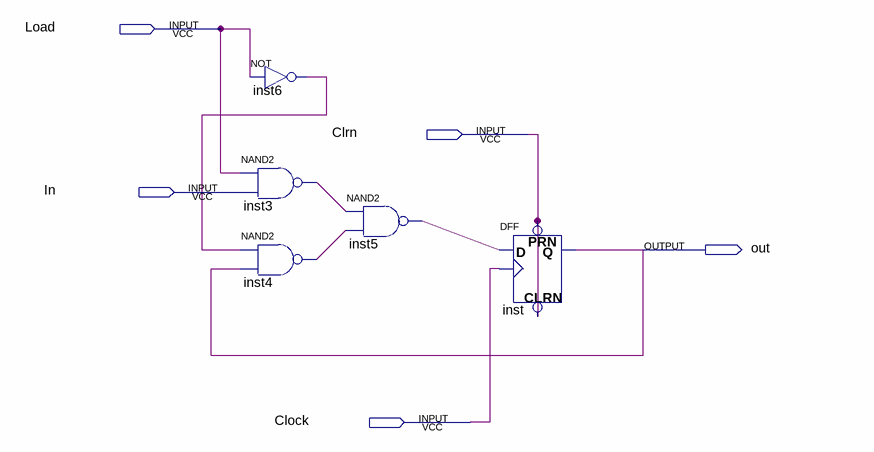
[diagram p0: schematic sheet]
// Quartus schematic register.bdf as structural Verilog: 5 symbols, 5 pins
module register (
  input  Load,
  input  Clrn,
  input  In,
  input  Clock,
  output out
);

  wire inst3_out, inst4_out, inst5_out, inst6_out;

  not inst6 (inst6_out, Load);
  nand inst3 (inst3_out, Load, In);
  nand inst4 (inst4_out, inst6_out, out);
  nand inst5 (inst5_out, inst3_out, inst4_out);
  DFF inst (.CLRN(Clrn), .CLK(Clock), .D(inst5_out), .PRN(Clrn), .Q(out));
endmodule
